# EAGLE schematic Motor_Driver (EAGLE 7.4.0)
DATABASE: C:\EAGLE-7.2.0\ulp\bom-ex164
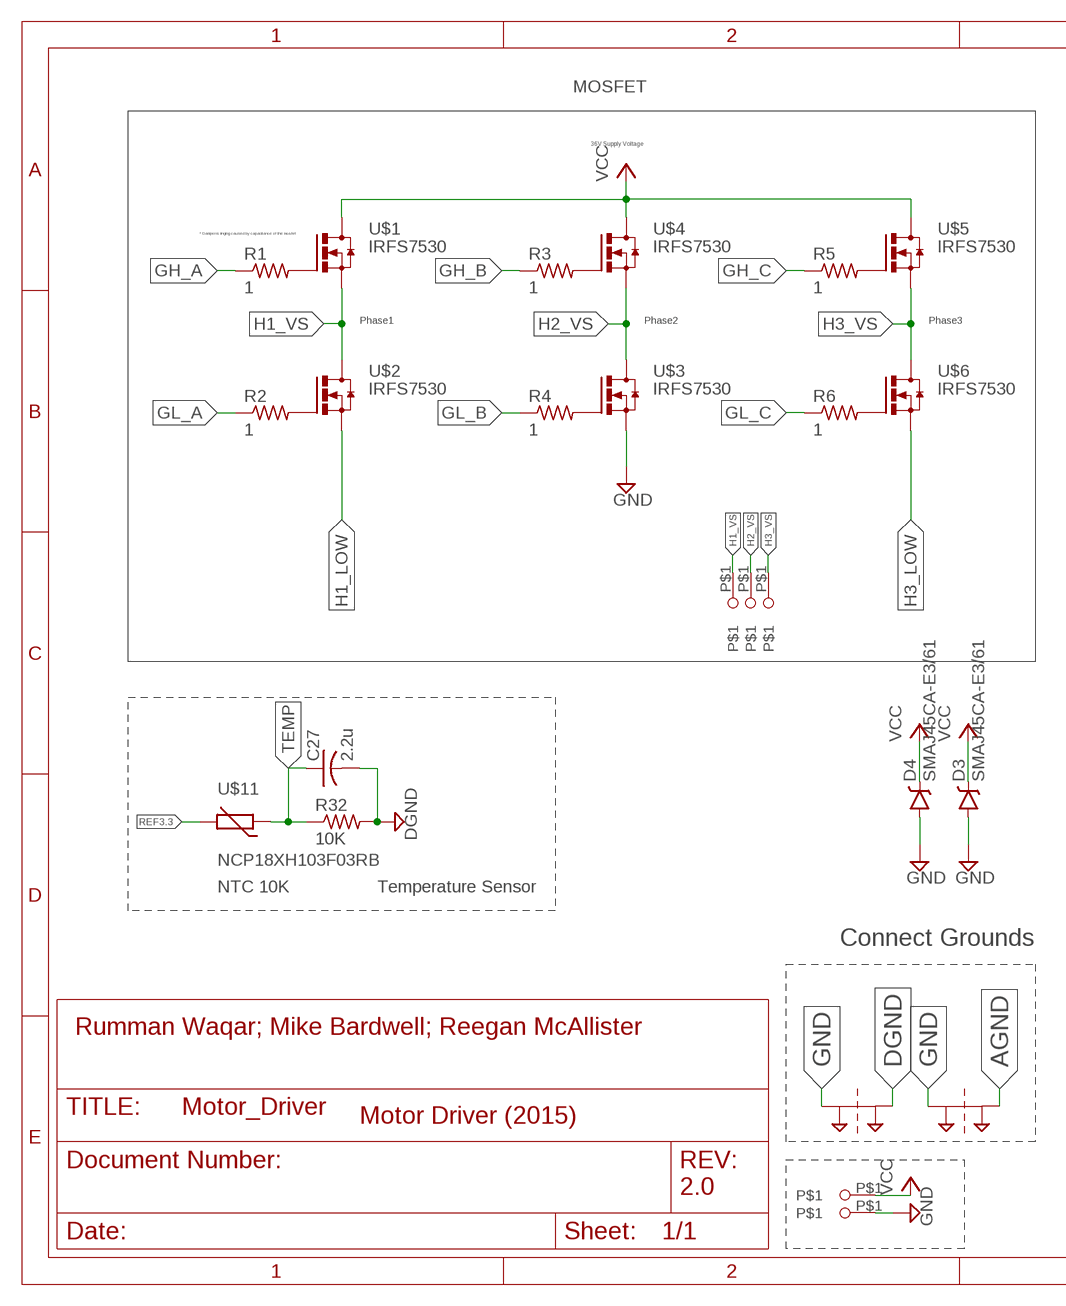
[diagram p0: schematic, sheet 1, part 1 of 2]
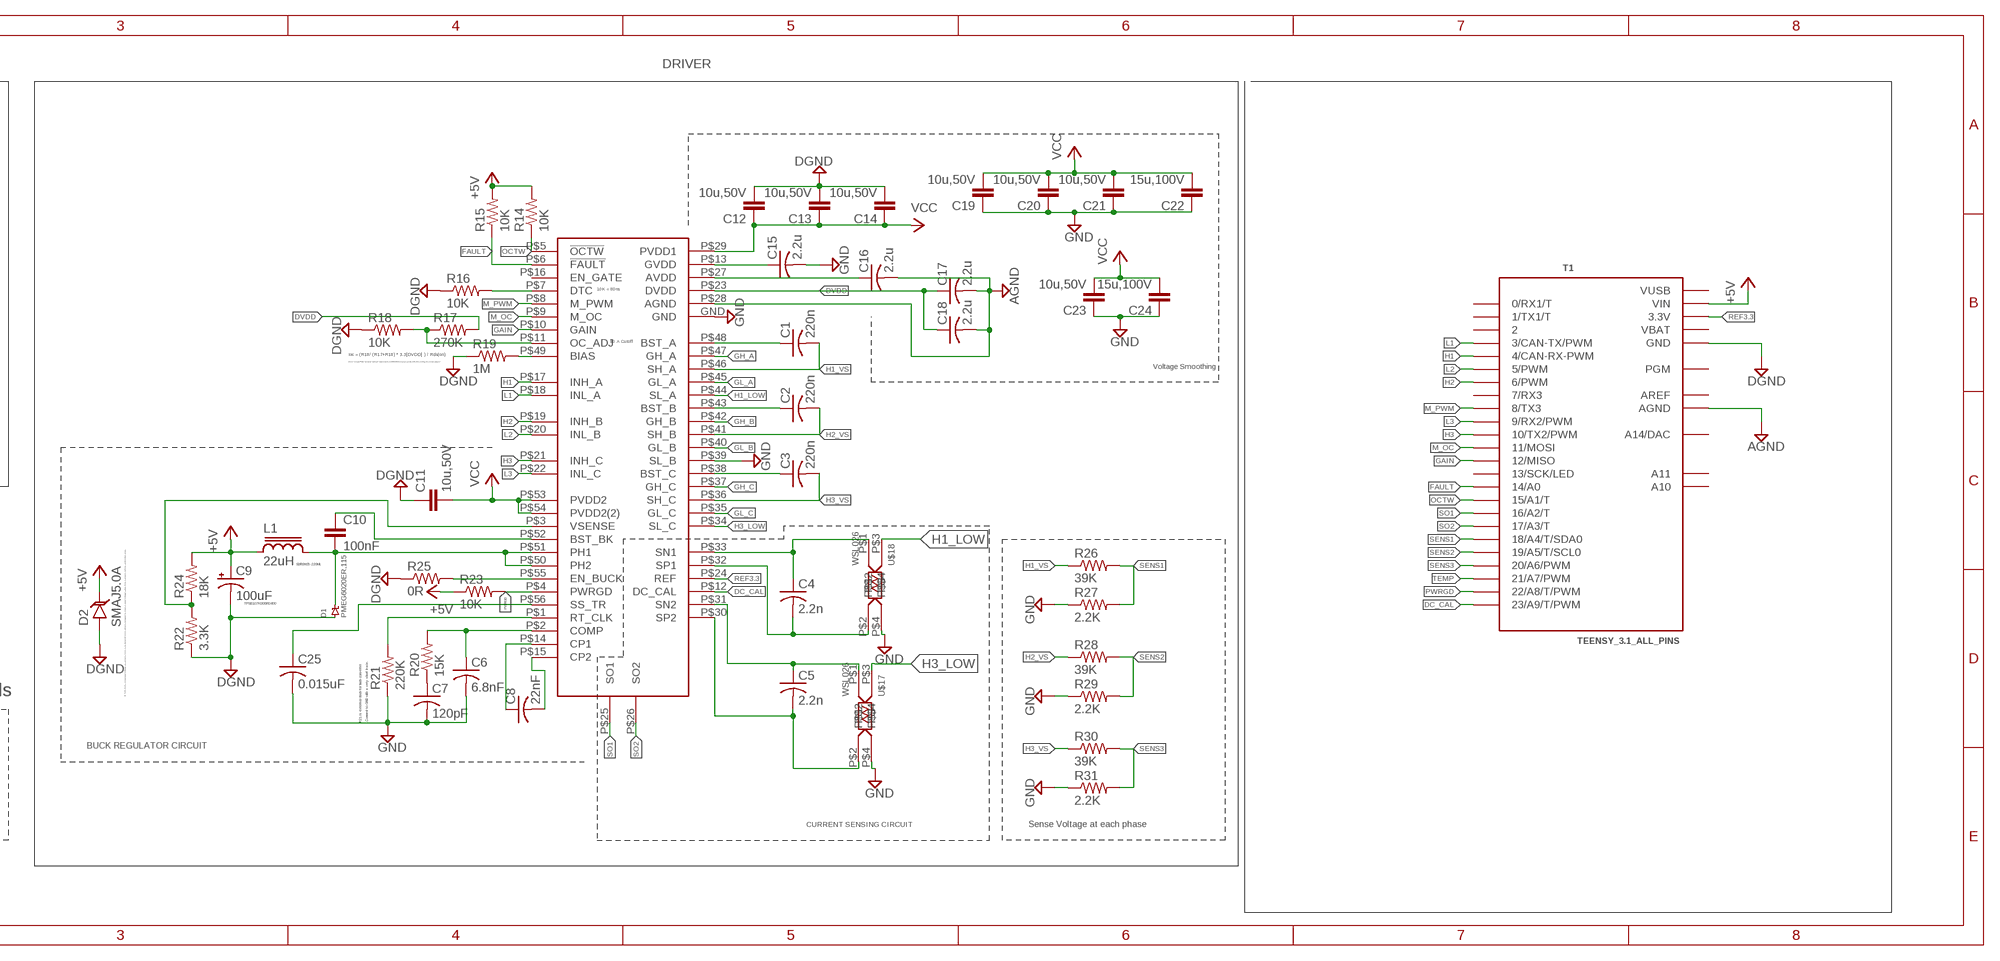
[diagram p1: schematic, sheet 1, part 2 of 2]

## Parts
C1  220n  C-USC0603  [C0603]
C2  220n  C-USC0603  [C0603]
C3  220n  C-USC0603  [C0603]
C4  2.2n  C-USC0603  [C0603]
C5  2.2n  C-USC0603  [C0603]
C6  6.8nF  C-USC0603  [C0603]
C7  120pF  C-USC0603  [C0603]
C8  22nF  C-USC0603  [C0603]
C9  100uF  CAP_POL3528-KIT  [EIA3528-KIT]
C10  100nF  CAP0805  [0805]
C11  10u,50V  CAP1206  [1206]
C12  10u,50V  CAP1206  [1206]
C13  10u,50V  CAP1206  [1206]
C14  10u,50V  CAP1206  [1206]
C15  2.2u  C-USC0603  [C0603]
C16  2.2u  C-USC0603  [C0603]
C17  2.2u  C-USC0603  [C0603]
C18  2.2u  C-USC0603  [C0603]
C19  10u,50V  CAP1206  [1206]
C20  10u,50V  CAP1206  [1206]
C21  10u,50V  CAP1206  [1206]
C22  15u,100V  C-EUC2220K  [C2220K]
C23  10u,50V  CAP1206  [1206]
C24  15u,100V  C-EUC2220K  [C2220K]
C25  0.015uF  C-USC0603  [C0603]
C27  2.2u  C-USC0603  [C0603]
D1  PMEG6020ER,115  DIODE[SCHOTKY]-SOD123W  [SOD123W]
D2  SMAJ5.0A  TVSSMA  [SMA-DIODE]
D3  SMAJ45CA-E3/61  MBRA140  [SMA-DIODE]
D4  SMAJ45CA-E3/61  MBRA140  [SMA-DIODE]
L1  22uH  SDR0805  [SDR0805]
PT1  2PT_GND_TIE  [2PT_GND_TIE]
PT2  2PT_GND_TIE  [2PT_GND_TIE]
R1  1  R-US_R0603  [R0603]
R2  1  R-US_R0603  [R0603]
R3  1  R-US_R0603  [R0603]
R4  1  R-US_R0603  [R0603]
R5  1  R-US_R0603  [R0603]
R6  1  R-US_R0603  [R0603]
R14  10K  R-US_R0603  [R0603]
R15  10K  R-US_R0603  [R0603]
R16  10K  R-US_R0603  [R0603]
R17  270K  R-US_R0603  [R0603]
R18  10K  R-US_R0603  [R0603]
R19  1M  R-US_R0603  [R0603]
R20  15K  R-US_R0603  [R0603]
R21  220K  R-US_R0603  [R0603]
R22  3.3K  R-US_R0603  [R0603]
R23  10K  R-US_R0603  [R0603]
R24  18K  R-US_R0603  [R0603]
R25  0R  R-US_R0603  [R0603]
R26  39K  R-US_R0603  [R0603]
R27  2.2K  R-US_R0603  [R0603]
R28  39K  R-US_R0603  [R0603]
R29  2.2K  R-US_R0603  [R0603]
R30  39K  R-US_R0603  [R0603]
R31  2.2K  R-US_R0603  [R0603]
R32  10K  R-US_M0805  [M0805]
T1  TEENSY_3.1_ALL_PINS  [TEENSY3-ALL_PINS]
U$1  IRFS7530  IRFS7530_HEATSINK  [IRF7530_HEATSINK]
U$2  IRFS7530  IRFS7530_HEATSINK  [IRF7530_HEATSINK]
U$3  IRFS7530  IRFS7530_HEATSINK  [IRF7530_HEATSINK]
U$4  IRFS7530  IRFS7530_HEATSINK  [IRF7530_HEATSINK]
U$5  IRFS7530  IRFS7530_HEATSINK  [IRF7530_HEATSINK]
U$6  IRFS7530  IRFS7530_HEATSINK  [IRF7530_HEATSINK]
U$7  DRV8302  [DRV8302]
U$11  NCP18XH103F03RB  [R0603]
U$12  1CONN_SOLDER  [1CONN_PAD]
U$13  1CONN_SOLDER  [1CONN_PAD]
U$14  1CONN_SOLDER  [1CONN_PAD]
U$15  1CONN_SOLDER  [1CONN_PAD]
U$16  1CONN_SOLDER  [1CONN_PAD]
U$17  WSL026  [REEL]
U$18  WSL026  [REEL]

## Nets
+5V: C9.A(+) D2.C L1.1 R14.2 R15.2 R23.1 R24.2 T1.VIN
AGND: C16.2 C17.2 C18.2 PT2.P$2 T1.AGND U$7.P$28(AGND)
DC_CAL: T1.23/A9(23/A9/T/PWM) U$7.P$12(DC_CAL)
DGND: C9.C(-) C11.1 C12.2 C13.2 C14.2 C27.2 D1.P$1 D2.A PT1.P$2 R16.1 R18.1 R19.1 R22.1 R25.1 R32.2 T1.GND T1.GND1(GND)
DVDD: C17.1 C18.1 R17.2 U$7.P$23(DVDD)
FAULT: R15.1 T1.14/A0 U$7.P$6(!FAULT)
GAIN: T1.12(12/MISO) U$7.P$10(GAIN)
GH_A: R1.1 U$7.P$47(GH_A)
GH_B: R3.1 U$7.P$42(GH_B)
GH_C: R5.1 U$7.P$37(GH_C)
GL_A: R2.1 U$7.P$45(GL_A)
GL_B: R4.1 U$7.P$40(GL_B)
GL_C: R6.1 U$7.P$35(GL_C)
GND: C6.2 C7.2 C15.2 C19.1 C20.1 C21.1 C22.1 C23.1 C24.1 C25.2 D3.A D4.A PT1.P$1 PT2.P$1 R21.1 R27.1 R29.1 R31.1 U$3.S1(S) U$3.S2(S) U$3.S3(S) U$3.S4(S) U$3.S5(S) U$7.GND U$7.P$39(SL_B) U$16.P$1 U$17.P$4 U$18.P$4
H1: T1.4(4/CAN-RX-PWM) U$7.P$17(INH_A)
H1_LOW: U$2.S1(S) U$2.S2(S) U$2.S3(S) U$2.S4(S) U$2.S5(S) U$7.P$44(SL_A) U$18.P$3
H1_VS: C1.2 R26.1 U$1.S1(S) U$1.S2(S) U$1.S3(S) U$1.S4(S) U$1.S5(S) U$2.D1(D) U$7.P$46(SH_A) U$14.P$1
H2: T1.6(6/PWM) U$7.P$19(INH_B)
H2_VS: C2.2 R28.1 U$3.D1(D) U$4.S1(S) U$4.S2(S) U$4.S3(S) U$4.S4(S) U$4.S5(S) U$7.P$41(SH_B) U$13.P$1
H3: T1.10(10/TX2/PWM) U$7.P$21(INH_C)
H3_LOW: U$6.S1(S) U$6.S2(S) U$6.S3(S) U$6.S4(S) U$6.S5(S) U$7.P$34(SL_C) U$17.P$3
H3_VS: C3.2 R30.1 U$5.S1(S) U$5.S2(S) U$5.S3(S) U$5.S4(S) U$5.S5(S) U$6.D1(D) U$7.P$36(SH_C) U$12.P$1
L1: T1.3(3/CAN-TX/PWM) U$7.P$18(INL_A)
L2: T1.5(5/PWM) U$7.P$20(INL_B)
L3: T1.9(9/RX2/PWM) U$7.P$22(INL_C)
M_OC: T1.11(11/MOSI) U$7.P$9(M_OC)
M_PWM: T1.8(8/TX3) U$7.P$8(M_PWM)
N$1: R1.2 U$1.G1(G)
N$2: R2.2 U$2.G1(G)
N$3: R4.2 U$3.G1(G)
N$4: R3.2 U$4.G1(G)
N$5: R5.2 U$5.G1(G)
N$6: R6.2 U$6.G1(G)
N$7: C1.1 U$7.P$48(BST_A)
N$8: R17.1 R18.2 U$7.P$11(OC_ADJ)
N$10: C8.1 U$7.P$14(CP1)
N$12: C2.1 U$7.P$43(BST_B)
N$13: C8.2 U$7.P$15(CP2)
N$14: C7.1 R20.1
N$15: R21.2 U$7.P$1(RT_CLK)
N$16: R16.2 U$7.P$7(DTC)
N$17: R25.2 U$7.P$55(EN_BUCK)
N$18: C15.1 U$7.P$13(GVDD)
N$19: C10.2 D1.P$2 L1.2 U$7.P$50(PH2) U$7.P$51(PH1)
N$20: C6.1 R20.2 U$7.P$2(COMP)
N$21: R19.2 U$7.P$49(BIAS)
N$22: C4.1 U$7.P$33(SN1) U$18.P$1
N$23: C4.2 U$7.P$32(SP1) U$18.P$2
N$24: C5.1 U$7.P$31(SN2) U$17.P$1
N$26: C3.1 U$7.P$38(BST_C)
N$27: C16.1 U$7.P$27(AVDD)
N$28: R22.2 R24.1 U$7.P$3(VSENSE)
N$29: C10.1 U$7.P$52(BST_BK)
N$30: C25.1 U$7.P$56(SS_TR)
N$31: C5.2 U$7.P$30(SP2) U$17.P$2
OCTW: R14.1 T1.15/A1(15/A1/T) U$7.P$5(!OCTW)
PWRGD: R23.2 T1.22/A8(22/A8/T/PWM) U$7.P$4(PWRGD)
REF3.3: T1.3.3V T1.3.3V1(3.3V) U$7.P$24(REF) U$11.2
SENS1: R26.2 R27.2 T1.18/A4(18/A4/T/SDA0)
SENS2: R28.2 R29.2 T1.19/A5(19/A5/T/SCL0)
SENS3: R30.2 R31.2 T1.20/A6(20/A6/PWM)
SO1: T1.16/A2(16/A2/T) U$7.P$25(SO1)
SO2: T1.17/A3(17/A3/T) U$7.P$26(SO2)
TEMP: C27.1 R32.1 T1.21/A7(21/A7/PWM) U$11.1
VCC: C11.2 C12.1 C13.1 C14.1 C19.2 C20.2 C21.2 C22.2 C23.2 C24.2 D3.C D4.C U$1.D1(D) U$4.D1(D) U$5.D1(D) U$7.P$29(PVDD1) U$7.P$53(PVDD2) U$7.P$54(PVDD2(2)) U$15.P$1
Unconnected: T1.0(0/RX1/T) T1.1(1/TX1/T) T1.2 T1.7(7/RX3) T1.13(13/SCK/LED) T1.A10 T1.A11 T1.PGM T1.RESET/DAC(A14/DAC) U$7.P$16(EN_GATE)

## Notes on the sheet
- MOSFET | DRIVER
- 36V Supply Voltage
- * Dampens ringing caused by capacitance of the mosfet
- Phase1 | Phase2 | Phase3
- 10K = 80ns
- 90 A Cutoff
- Ioc = (R18/ (R17+R18) * 3.3[DVDD] ) / Rds(on)
- Don't mount R18, because internal current limit of DRV8302 doesn't work with this config for some reason
- Voltage Smoothing
- SDR0805-220ML
- TPSB107K006R0400
- NTC 10K | Temperature Sensor
- Connect Grounds | A TVS diode, or transient voltage suppression diode, is an electrical device which is designed to divert or shunt voltage spikes from a circuit in order to protect that circuit.
- R21 is external clock for buck converter. | Connect to GND with a very short trace.
- BUCK REGULATOR CIRCUIT
- Rumman Waqar; Mike Bardwell; Reegan McAllister
- Motor Driver (2015) | CURRENT SENSING CIRCUIT | Sense Voltage at each phase
- 2.0

## Power pins joined to a net without a drawn wire
AREF: T1.AREF
VBAT: T1.VBAT
VUSB: T1.VUSB

## Library data of the parts
C1-C8 C15-C18 C25 C27 = adafruit:C-US: CAPACITOR, American symbol
C9 = SparkFun-Capacitors:CAP_POL: Capacitor Polarized These are standard SMD and PTH capacitors. Normally 10uF, 47uF, and 100uF in electrolytic and tantalum varieties. Always verify the external diameter of the through hole cap, it varies with capacity, voltage, and manufacturer. The EIA devices should be standard.
C10-C14 C19-C21 C23 = SparkFun-Passives:CAP: Capacitor Standard 0603 ceramic capacitor, and 0.1" leaded capacitor.
C22 C24 = resistor:C-EU: CAPACITOR, European symbol
D1 = nxp:DIODE[SCHOTKY]
D2 = SparkFun-DiscreteSemi:TVS: Transient voltage suppressor- prevents ESD on inputs.
D3 D4 = SparkFun-DiscreteSemi:MBRA140: 40V, 1A Schottky rectifier SMA/DO-214AC package DIO-08053; PROD_ID: DIO-08053
L1 = bourne:SDR0805: POWER INDUCTOR
PT1 PT2 = SparkFun-Passives:2PT_GND_TIE: Package for connecting two ground nets in one place.
R1-R6 R14-R32 = adafruit:R-US_: RESISTOR, American symbol
T1 = Teensy_3_and_LC_Series_Boards_v1.1:TEENSY_3.1_ALL_PINS: Footprint for Teensy 3.1 or 3.2 board using all through-holes, i.e. the entire perimeter plus the 4 through-holes inboard (A10,A11,AREF, VUSB)
U$1-U$6 = bldc_lib:IRFS7530_HEATSINK: IRFS7530 with Heatsink
U$7 = bldc_lib:DRV8302: DRV8302 3-Phase Brushless Motor Pre-Driver with Dual Current Sense Amps and Buck Converter (PWM Ctrl)
U$11 = bldc_lib:NCP18XH103F03RB: NTC Thermistor NTC Thermistors 10K OHM 1%
U$12-U$16 = bldc_lib:1CONN_SOLDER
U$17 U$18 = WSL:WSL026